# EAGLE design TinyCube11b_Lib (EAGLE 7.5.0)
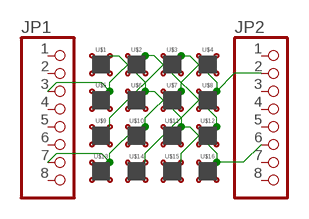
[diagram p0: schematic, sheet 1]

## Parts
JP1  PINHD-1X8BIG  [1X08-BIG]
JP2  PINHD-1X8BIG  [1X08-BIG]
U$1  PILLAR  [10MIL]
U$2  PILLAR  [10MIL]
U$3  PILLAR  [10MIL]
U$4  PILLAR  [10MIL]
U$5  PILLAR  [10MIL]
U$6  PILLAR  [10MIL]
U$7  PILLAR  [10MIL]
U$8  PILLAR  [10MIL]
U$9  PILLAR  [10MIL]
U$10  PILLAR  [10MIL]
U$11  PILLAR  [10MIL]
U$12  PILLAR  [10MIL]
U$13  PILLAR  [10MIL]
U$14  PILLAR  [10MIL]
U$15  PILLAR  [10MIL]
U$16  PILLAR  [10MIL]

## Nets
N$1: JP1.3 U$2.+(G) U$5.+(G) U$12.+(G) U$15.+(G)
N$2: JP1.7 U$4.+(G) U$7.+(G) U$10.+(G) U$13.+(G)
N$3: JP2.6 U$1.+(G) U$6.+(G) U$11.+(G) U$16.+(G)
N$4: JP2.2 U$3.+(G) U$8.+(G) U$9.+(G) U$14.+(G)
Unconnected: JP1.1 JP1.2 JP1.4 JP1.5 JP1.6 JP1.8 JP2.1 JP2.3 JP2.4 JP2.5 JP2.7 JP2.8 U$1.B(R) U$1.G(A) U$1.R(B) U$2.B(R) U$2.G(A) U$2.R(B) U$3.B(R) U$3.G(A) U$3.R(B) U$4.B(R) U$4.G(A) U$4.R(B) U$5.B(R) U$5.G(A) U$5.R(B) U$6.B(R) U$6.G(A) U$6.R(B) U$7.B(R) U$7.G(A) U$7.R(B) U$8.B(R) U$8.G(A) U$8.R(B) U$9.B(R) U$9.G(A) U$9.R(B) U$10.B(R) U$10.G(A) U$10.R(B) U$11.B(R) U$11.G(A) U$11.R(B) U$12.B(R) U$12.G(A) U$12.R(B) U$13.B(R) U$13.G(A) U$13.R(B) U$14.B(R) U$14.G(A) U$14.R(B) U$15.B(R) U$15.G(A) U$15.R(B) U$16.B(R) U$16.G(A) U$16.R(B)

## Library data of the parts
JP1 JP2 = adafruit:PINHD-1X8: PIN HEADER
U$1-U$16 = PILLAR:PILLAR

## Board
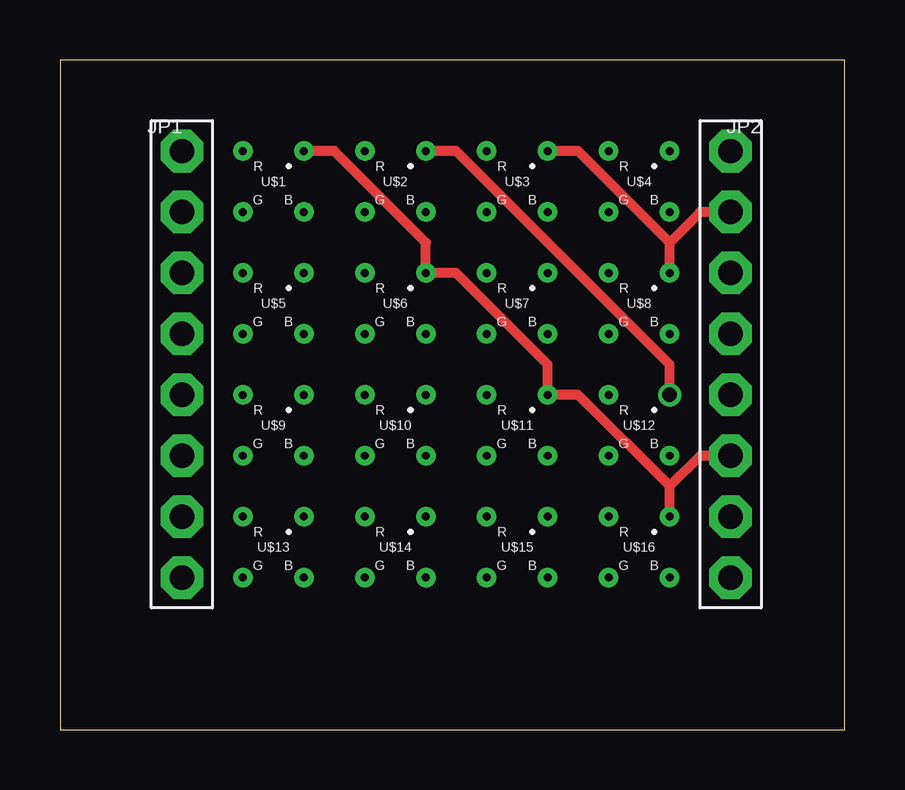
[diagram p1: board, top side]
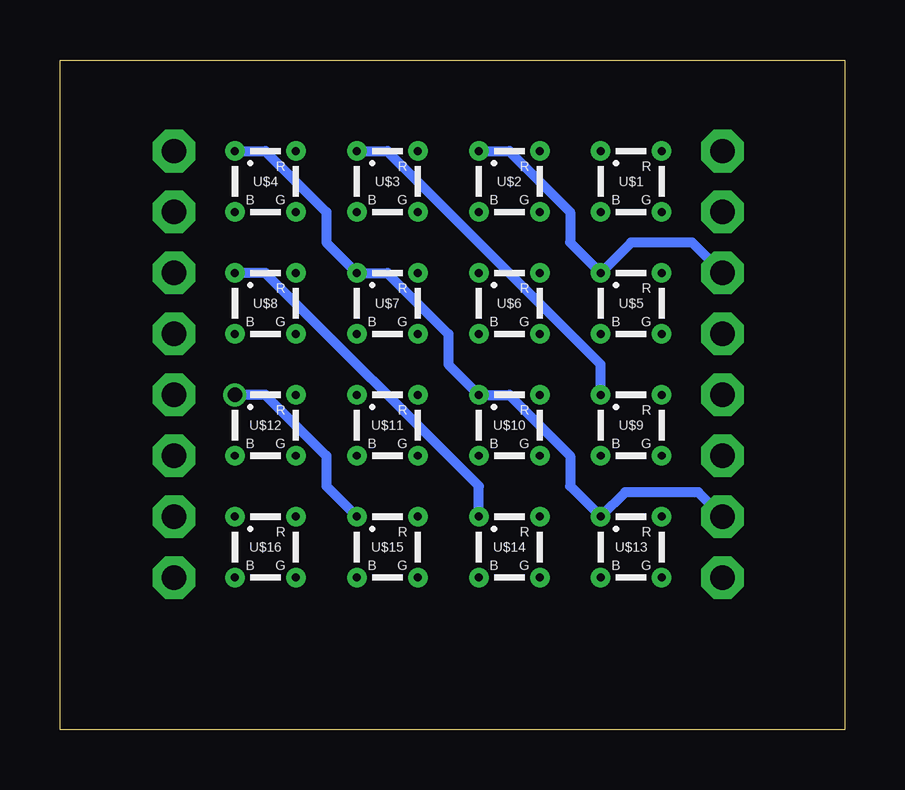
[diagram p2: board, bottom side, seen from below]

Size 32.69 x 27.93 mm. Coordinates in mm from the lower left corner, seen from the top.
Outline: 0,0 32.69,0 32.69,27.93 0,27.93 0,0
Copper layers (1*16): Top 0.0356mm / dielectric 1.5011mm / Bottom 0.0356mm
Design rules "LaenPCBOrder": minimum track width 6mil, minimum drill 13mil, track to track 6mil, track to pad 6mil, pad to pad 6mil, via to via 6mil, smd to smd 6mil, copper to edge 15mil, drill to drill 6mil, minimum pad ring 7mil, minimum via ring 7mil, stop-mask expansion 3mil, vias tented up to drill 0mil, thermal gap 10mil

### Footprints (pad centres in the part's own frame; a part is rotated, then mirrored left to right if it is on the bottom)
1X08-BIG = drill 1.016 pad 1.778 octagon: 1 -8.89,0; 2 -6.35,0; 3 -3.81,0; 4 -1.27,0; 5 1.27,0; 6 3.81,0; 7 6.35,0; 8 8.89,0
10MIL = drill 0.33 pad 0.813: + 1.27,1.27; B 1.27,-1.27; G -1.27,-1.27; R -1.27,1.27

### Placement (x,y rotation side)
JP1  5.08,15.24 270 top
JP2  27.94,15.24 270 top
U$1  8.89,22.86 0 top
U$2  13.97,22.86 0 top
U$3  19.05,22.86 0 top
U$4  24.13,22.86 0 top
U$5  8.89,17.78 0 top
U$6  13.97,17.78 0 top
U$7  19.05,17.78 0 top
U$8  24.13,17.78 0 top
U$9  8.89,12.7 0 top
U$10  13.97,12.7 0 top
U$11  19.05,12.7 0 top
U$12  24.13,12.7 0 top
U$13  8.89,7.62 0 top
U$14  13.97,7.62 0 top
U$15  19.05,7.62 0 top
U$16  24.13,7.62 0 top

### Tracks (layer width: path | path; a pad name or v marks a point on that pad's centre or on a via)
N$1  (via drill 0.6 pad 0.61)
  Top 0.406: U$12.+ 25.4,15.24 16.51,24.13 U$2.+
  Bottom 0.406: U$15.+ 21.59,10.16 21.59,11.43 24.13,13.97 U$12.+ | JP1.3 6.35,20.32 8.89,20.32 U$5.+ 11.43,20.32 11.43,21.59 13.97,24.13 U$2.+
  other vias: 25.4,13.97
N$2
  Bottom 0.406: U$4.+ 24.13,24.13 21.59,21.59 21.59,20.32 U$7.+ 19.05,19.05 16.51,16.51 16.51,15.24 U$10.+ 13.97,13.97 11.43,11.43 11.43,10.16 U$13.+ 9.14,9.91 6.1,9.91 JP1.7
N$3
  Top 0.406: U$16.+ 25.4,10.16 | 25.4,10.16 21.59,13.97 U$11.+ 20.32,15.24 16.51,19.05 U$6.+ 15.24,20.32 11.43,24.13 U$1.+ | JP2.6 26.67,11.43 25.4,10.16
N$4  (via drill 0.33)
  Top 0.406: U$8.+ 25.4,20.32 | 25.4,20.32 21.59,24.13 U$3.+ | JP2.2 26.67,21.59 25.4,20.32
  Bottom 0.406: U$9.+ 10.16,15.24 19.05,24.13 U$3.+ | U$14.+ 15.24,10.16 24.13,19.05 U$8.+
  other vias: 25.4,19.05